# Altium schematic sheet Debug.SchDoc
size A3; DocumentNumber: 7; SheetNumber: 7; SheetTotal: 9; PageSetup: Record=PageOptions|CenterHorizontal=True|CenterVertical=True|PrintScale=0.97|XCorrection=1.00|YCorrection=1.00|PrintKind=1|BorderSize=5000000|LeftOffset=0|BottomOffset=0|Orientation=2|PaperLength=2970|PaperWidth=2100|Scale=100|PaperSource=7|PrintQuality=600|MediaType=1|DitherType=10|PaperKind=A4|PrintScaleMode=1
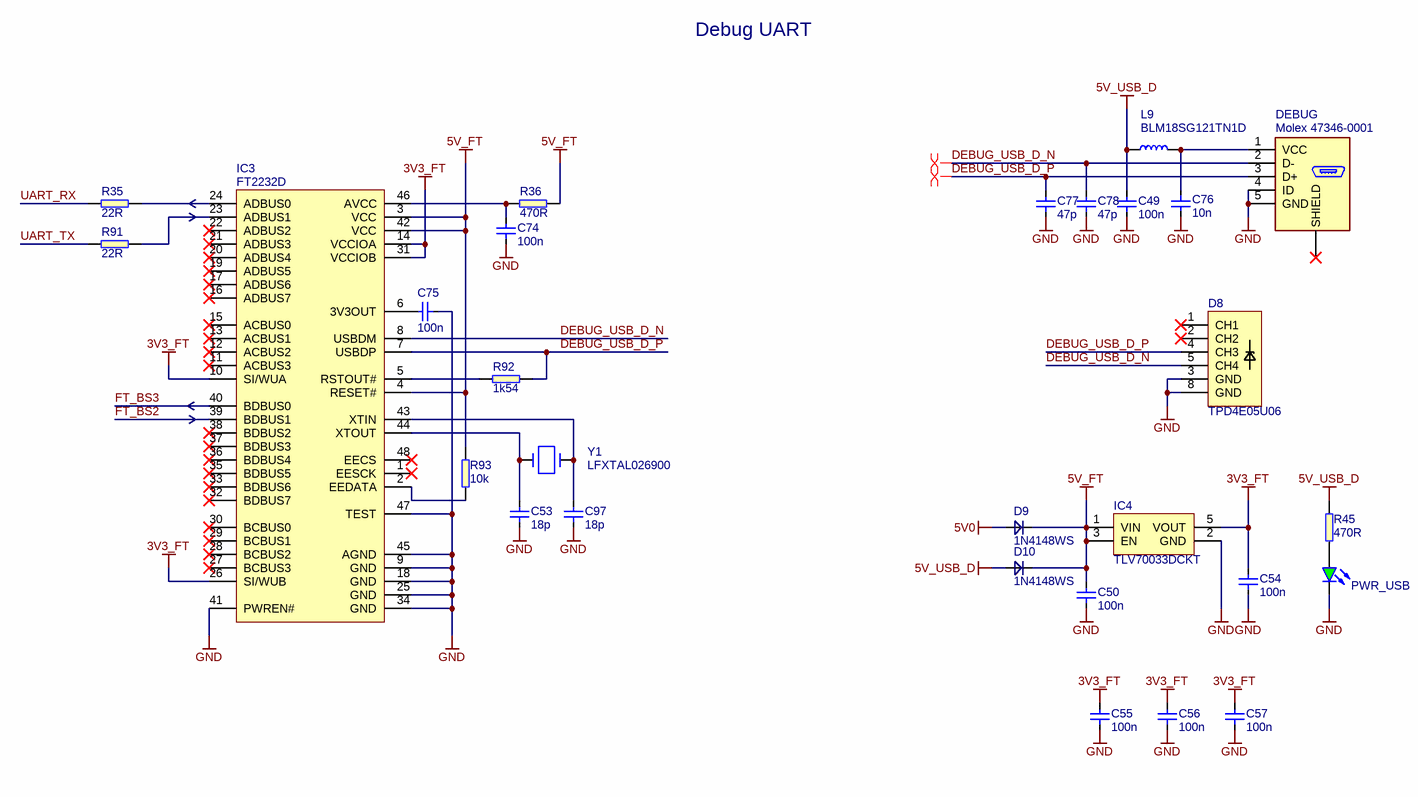
[diagram p0: Debug.SchDoc]

## Parts
C49  100n  [0603]
C50  100n  [0402]
C53  18p  [0402]
C54  100n  [0402]
C55  100n  [0402]
C56  100n  [0402]
C57  100n  [0402]
C74  100n  [0402]
C75  100n  [0402]
C76  10n  [0603]
C77  47p  [0402]
C78  47p  [0402]
C97  18p  [0402]
D8  TPD4E05U06  [TPD4E05U06_PASS]
D9  1N4148WS  [SOD-323]
D10  1N4148WS  [SOD-323]
DEBUG  Molex 47346-0001  [CON-Molex-047346-0001]
IC3  FT2232D  [LQFP-48]
IC4  TLV70033DCKT  [SC70-5]
L9  BLM18SG121TN1D  [0603]
PWR_USB  KPT-1608SGC  [LED0603]  (value not drawn)
R35  22R  [0402]
R36  470R  [0402]
R45  470R  [0603]
R91  22R  [0402]
R92  1k54  [0402]
R93  10k  [0402]
Y1  LFXTAL026900  [crystal_smd]

## Nets
3V3_FT: C54.2 C55.2 C56.2 C57.2 IC3.10(SI/WUA) IC3.14(VCCIOA) IC3.26(SI/WUB) IC3.31(VCCIOB) IC4.5(VOUT)
5V0: D9.A
5V_FT: C50.2 D9.C D10.C IC3.3(VCC) IC3.4(RESET#) IC3.42(VCC) IC4.1(VIN) IC4.3(EN) R36.1 R93.2
5V_USB_D: C49.2 D10.A L9.1 R45.2
GND: C49.1 C50.1 C53.1 C54.1 C55.1 C56.1 C57.1 C74.1 C75.1 C76.2 C77.1 C78.1 C97.1 D8.3(GND) D8.8(GND) DEBUG.4(ID) DEBUG.5(GND) IC3.9(GND) IC3.18(GND) IC3.25(GND) IC3.34(GND) IC3.41(PWREN#) IC3.45(AGND) IC3.47(TEST) IC4.2(GND) PWR_USB.K
DEBUG_USB_D_N: C78.2 D8.5(CH4) DEBUG.2(D-) IC3.8(USBDM)
DEBUG_USB_D_P: C77.2 D8.4(CH3) DEBUG.3(D+) IC3.7(USBDP) R92.1
FT_BS2: IC3.39(BDBUS1)
FT_BS3: IC3.40(BDBUS0)
UART_RX: R35.1
UART_TX: R91.1
NetC53_2: C53.2 IC3.44(XTOUT) Y1.2
NetC74_2: C74.2 IC3.46(AVCC) R36.2
NetC75_2: C75.2 IC3.6(3V3OUT)
NetC76_1: C76.1 DEBUG.1(VCC) L9.2
NetC97_2: C97.2 IC3.43(XTIN) Y1.1
NetIC3_2: IC3.2(EEDATA) R93.1
NetIC3_5: IC3.5(RSTOUT#) R92.2
NetIC3_23: IC3.23(ADBUS1) R91.2
NetIC3_24: IC3.24(ADBUS0) R35.2
NetPWR_USB_A: PWR_USB.A R45.1

Not connected (* = marked no-connect by the designer): D8 1(CH1)* 2(CH2)*; DEBUG S(SHIELD)*; IC3 1(EESCK)* 11(ACBUS3)* 12(ACBUS2)* 13(ACBUS1)* 15(ACBUS0)* 16(ADBUS7)* 17(ADBUS6)* 19(ADBUS5)* 20(ADBUS4)* 21(ADBUS3)* 22(ADBUS2)* 27(BCBUS3)* 28(BCBUS2)* 29(BCBUS1)* 30(BCBUS0)* 32(BDBUS7)* 33(BDBUS6)* 35(BDBUS5)* 36(BDBUS4)* 37(BDBUS3)* 38(BDBUS2)* 48(EECS)*

## Layout directives
differential pair: DEBUG_USB_D_N, DEBUG_USB_D_P

## Notes on the sheet
- Debug UART
- Title:
- Size:
- Date:
- A3
- Revision:
- Page:
- of
- Antmicro Ltd.
- File:
- www.antmicro.com

## Library data of the parts
C49 = C_100n_0603: MLCC SMT Capacitor 100nF 0603; Manufacturer: WALSIN; MPN: 0603B104K500CT; Value: 100n; Part Number: C_100n_0603
C50 C54-C57 C74 C75 = C_100n_0402: MLCC SMT Capacitor 100nF 0402; Manufacturer: MULTICOMP; MPN: MC0402X104M100CT; Value: 100n; Part Number: C_100n_0402
C53 C97 = C_18p_0402: MLCC SMT Capacitor 18pF 0603; Manufacturer: KEMET; MPN: C0402C180J5GACAUTO; Value: 18p; Part Number: C_18p_0402
C76 = C_10n_0603: MLCC SMT Capacitor 10nF 0603; Manufacturer: AVX; MPN: 06031C103JAT2A; Value: 10n; Part Number: C_10n_0603
C77 C78 = C_47p_0402: MLCC SMT Capacitor 47pF 0402; Manufacturer: KEMET; MPN: C0402C470J5GACTU; Value: 47p; Part Number: C_47p_0402
D8 = TPD4E05U06_PASS: ESD Suppressors 4-CH; Manufacturer: Texas Instruments; MPN: TPD4E05U06DQAR; Part Number: TPD4E05U06_PASS; Value: TPD4E05U06
D9 D10 = 1N4148WS: Diode small signal; Manufacturer: MULTICOMP; Part Number: 1N4148WS; Value: 1N4148WS; MPN: 1N4148WS
DEBUG = CON-Molex-47346-0001: USB - micro B Receptacle Connector 5 Position Surface Mount, Right Angle, Horizontal; MPN: 473460001; Part Number: CON-Molex-47346-0001; Value: Molex 47346-0001; Manufacturer: Molex
IC3 = FT2232D: Dual USB-UART/FIFO; Manufacturer: FTDI; MPN: FT2232D-REEL; Part Number: FT2232D; Value: FT2232D
IC4 = TLV70033DCKT: Voltage Regulator, 2V to 5.5V, 175mV Dropout, 3.3Vout, 200mAout; Manufacturer: TEXAS INSTRUMENTS; Part Number: TLV70033DCKT; Value: TLV70033DCKT; MPN: TLV70033DCKT
L9 = BLM18SG121TN1D: FERRITE BEAD, 0.025OHM, 3A, 0603; Manufacturer: MURATA; Part Number: BLM18SG121TN1D; Value: BLM18SG121TN1D; MPN: BLM18SG121TN1D
PWR_USB = LED_G: LED Green 0603 case; Part Number: LED_G; Manufacturer: KINGBRIGHT; Value: KPT-1608SGC; MPN: KPT-1608SGC
R35 R91 = R_22R_0402: SMT Resistor 22R 0402; Manufacturer: VISHAY; MPN: CRCW040222R0FKED; Value: 22R; Part Number: R_22R_0402
R36 = R_470R_0402: SMT Resistor 470R 0402; Manufacturer: VISHAY; MPN: CRCW0402470RFKED.; Value: 470R; Part Number: R_470R_0402
R45 = R_470R_0603: SMT Resistor 470R 0603; Manufacturer: BOURNS; MPN: CR0603-JW-471GLF; Value: 470R; Part Number: R_470R_0603
R92 = R_1k54_0402: SMT Resistor 1k54 0402; Manufacturer: VISHAY; MPN: CRCW04021K54FKED.; Value: 1k54; Part Number: R_1k54_0402
R93 = R_10k_0402: SMT Resistor 0402; Manufacturer: MULTICOMP; MPN: MCMR04X1002FTL; Value: 10k; Part Number: R_10k_0402
Y1 = CRYSTAL_6MHz_SMD: CRYSTAL, 6MHZ, 18PF, SMD; Manufacturer: IQD FREQUENCY PRODUCTS; Value: LFXTAL026900; Part Number: CRYSTAL_6MHz_SMD; MPN: LFXTAL026900